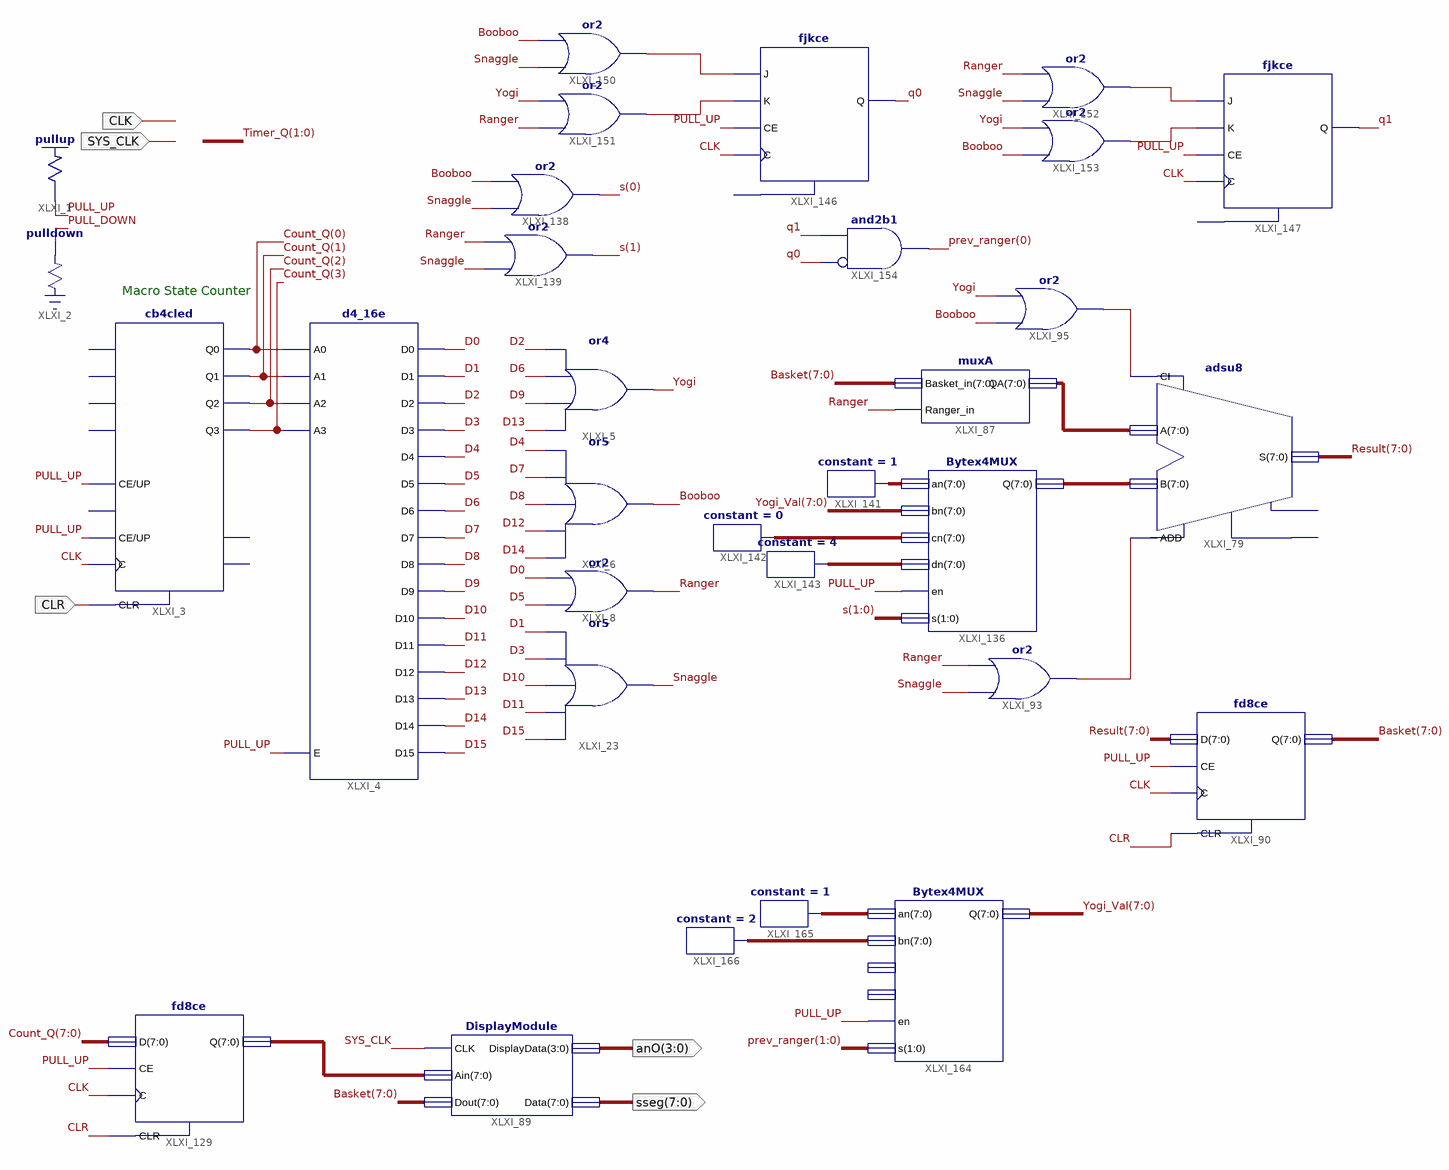
[diagram p0: schematic sheet 1]
// Xilinx ISE schematic Exp6.sch (spartan3e) as structural Verilog: 31 symbols, 5 ports
module Exp6 (
  input  SYS_CLK,
  input  CLK,
  input  CLR,
  output [7:0] sseg,
  output [3:0] anO
);

  wire Booboo, D0, D1, D2, D3, D4, D5, D6, D7, D8, D9, D10, D11, D12, D13, D14, D15, PULL_DOWN, PULL_UP, q0,
       q1, R, Ranger, Snaggle, XLXN_147, XLXN_379, XLXN_380, XLXN_381, XLXN_384, Yogi;
  wire [1:0] prev_ranger, s;
  wire [7:0] Basket, Count_Q, Result, XLXN_98, XLXN_99, XLXN_328, XLXN_364, XLXN_365, XLXN_366, XLXN_448,
       XLXN_449, Yogi_Val;

  \pullup  XLXI_1 (.O(PULL_UP));
  \pulldown  XLXI_2 (.O(PULL_DOWN));
  d4_16e XLXI_4 (
    .A0(Count_Q[0]), .A1(Count_Q[1]), .A2(Count_Q[2]), .A3(Count_Q[3]), .E(PULL_UP), .D0(D0), .D1(D1),
    .D10(D10), .D11(D11), .D12(D12), .D13(D13), .D14(D14), .D15(D15), .D2(D2), .D3(D3), .D4(D4), .D5(D5),
    .D6(D6), .D7(D7), .D8(D8), .D9(D9));
  or XLXI_5 (Yogi, D13, D9, D6, D2);
  or XLXI_6 (Booboo, D14, D12, D8, D7, D4);
  or XLXI_8 (Ranger, D5, D0);
  or XLXI_23 (Snaggle, D15, D11, D10, D3, D1);
  cb4cled XLXI_3 (
    .C(CLK), .CE(PULL_UP), .CLR(CLR), .UP(PULL_UP), .Q0(Count_Q[0]), .Q1(Count_Q[1]), .Q2(Count_Q[2]),
    .Q3(Count_Q[3]));  // open: D0, D1, D2, D3, L, CEO, TC
  muxA XLXI_87 (.Basket_in(Basket), .Ranger_in(Ranger), .QA(XLXN_98));
  adsu8 XLXI_79 (.A(XLXN_98), .ADD(R), .B(XLXN_99), .CI(XLXN_147), .S(Result));  // open: CO, OFL
  or XLXI_95 (XLXN_147, Booboo, Yogi);
  fjkce XLXI_146 (.C(CLK), .CE(PULL_UP), .J(XLXN_381), .K(XLXN_384), .Q(q0));  // open: CLR
  fjkce XLXI_147 (.C(CLK), .CE(PULL_UP), .J(XLXN_380), .K(XLXN_379), .Q(q1));  // open: CLR
  or XLXI_138 (s[0], Snaggle, Booboo);
  or XLXI_139 (s[1], Snaggle, Ranger);
  or XLXI_150 (XLXN_381, Snaggle, Booboo);
  or XLXI_151 (XLXN_384, Ranger, Yogi);
  or XLXI_152 (XLXN_380, Snaggle, Ranger);
  or XLXI_153 (XLXN_379, Booboo, Yogi);
  and XLXI_154 (prev_ranger[0], ~q0, q1);  // and2b1
  DisplayModule XLXI_89 (.CLK(SYS_CLK), .Ain(XLXN_328), .Dout(Basket), .DisplayData(anO), .Data(sseg));
  fd8ce XLXI_129 (.C(CLK), .CE(PULL_UP), .CLR(CLR), .D(Count_Q), .Q(XLXN_328));
  or XLXI_93 (R, Snaggle, Ranger);
  fd8ce XLXI_90 (.C(CLK), .CE(PULL_UP), .CLR(CLR), .D(Result), .Q(Basket));
  Bytex4MUX XLXI_164 (.en(PULL_UP), .s(prev_ranger), .Q(Yogi_Val), .bn(XLXN_449), .an(XLXN_448));  // open: cn, dn
  constant #(.CValue("1")) XLXI_165 (.O(XLXN_448));
  constant #(.CValue("2")) XLXI_166 (.O(XLXN_449));
  constant #(.CValue("0")) XLXI_142 (.O(XLXN_365));
  constant #(.CValue("4")) XLXI_143 (.O(XLXN_366));
  constant #(.CValue("1")) XLXI_141 (.O(XLXN_364));
  Bytex4MUX XLXI_136 (.cn(XLXN_365), .dn(XLXN_366), .en(PULL_UP), .s(s), .Q(XLXN_99), .bn(Yogi_Val), .an(XLXN_364));

  // Notes on the sheet:
  //   Macro State Counter
endmodule
